# Altium project CLS_Project.PrjPcb (part 1 of 2)
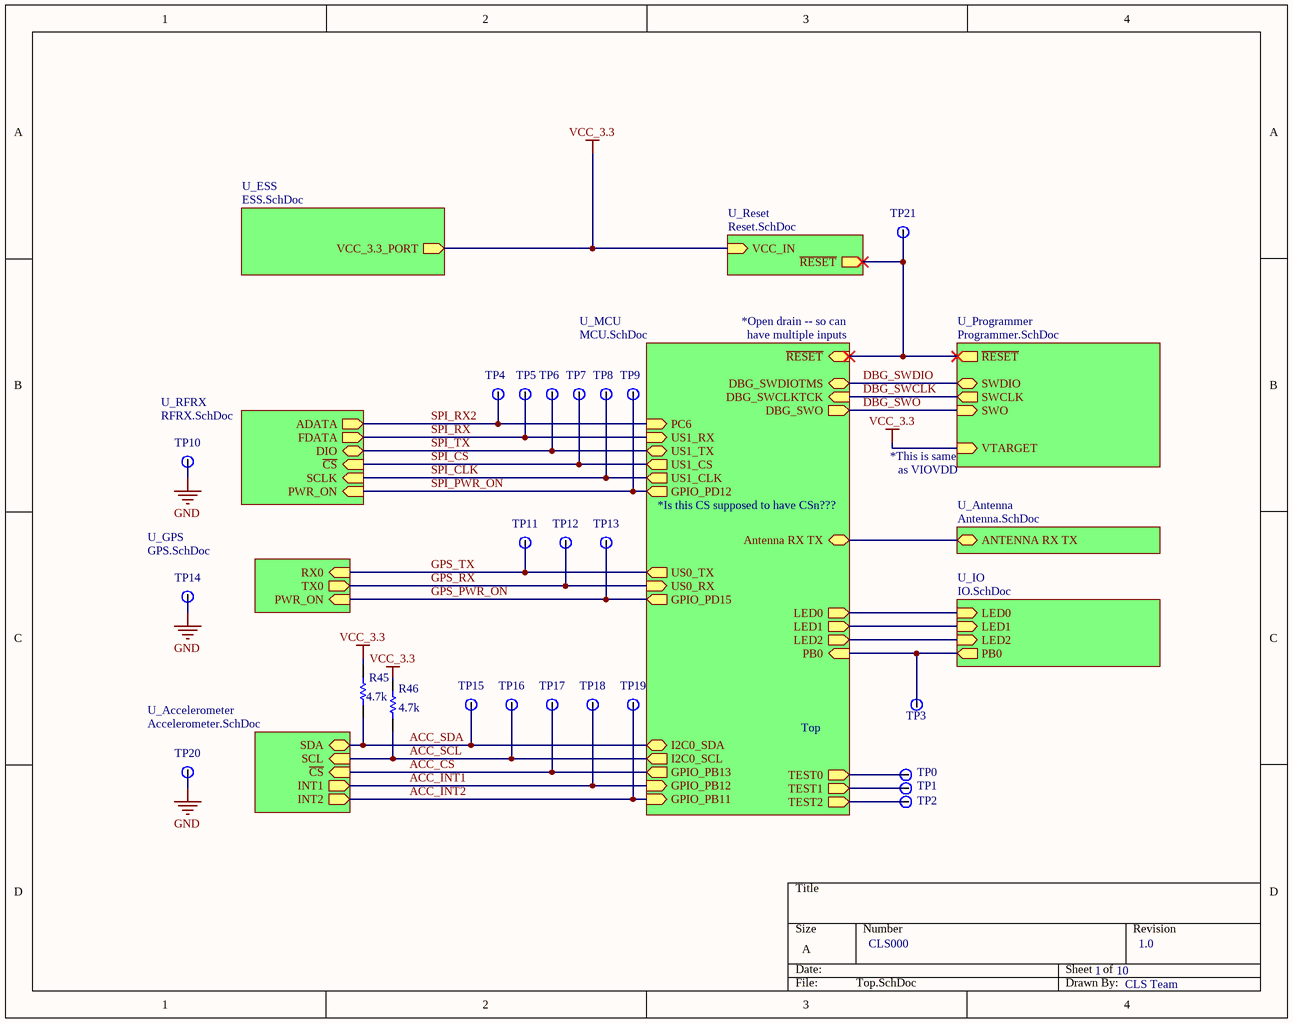
[diagram p0: Top.SchDoc]
10 sheets, 134 parts. Net scope: hierarchical (ports join the sheet entries above them; power ports are global).
Board file: PCB_draft_00.PcbDoc
Sheets:
  Top.SchDoc
    U_MCU = MCU.SchDoc
    U_Accelerometer = Accelerometer.SchDoc
    U_GPS = GPS.SchDoc
    U_Programmer = Programmer.SchDoc
    U_IO = IO.SchDoc
    U_RFRX = RFRX.SchDoc
    U_ESS = ESS.SchDoc
    U_Reset = Reset.SchDoc
    U_Antenna = Antenna.SchDoc

## Sheet Top.SchDoc: Top
size A; Author: CLS Team; Revision: 1.0; SheetNumber: 1; SheetTotal: 10

### Parts
R45  value 4.7k  [0805_CHIP_FP]  (hidden comment: Resistor_0805)
R46  value 4.7k  [0805_CHIP_FP]  (hidden comment: Resistor_0805)
TP0  Testpoint  [HDR1X1]  (value not drawn)
TP1  Testpoint  [HDR1X1]  (value not drawn)
TP2  Testpoint  [HDR1X1]  (value not drawn)
TP3  Testpoint  [HDR1X1]  (value not drawn)
TP4  Testpoint  [HDR1X1]  (value not drawn)
TP5  Testpoint  [HDR1X1]  (value not drawn)
TP6  Testpoint  [HDR1X1]  (value not drawn)
TP7  Testpoint  [HDR1X1]  (value not drawn)
TP8  Testpoint  [HDR1X1]  (value not drawn)
TP9  Testpoint  [HDR1X1]  (value not drawn)
TP10  Testpoint  [HDR1X1]  (value not drawn)
TP11  Testpoint  [HDR1X1]  (value not drawn)
TP12  Testpoint  [HDR1X1]  (value not drawn)
TP13  Testpoint  [HDR1X1]  (value not drawn)
TP14  Testpoint  [HDR1X1]  (value not drawn)
TP15  Testpoint  [HDR1X1]  (value not drawn)
TP16  Testpoint  [HDR1X1]  (value not drawn)
TP17  Testpoint  [HDR1X1]  (value not drawn)
TP18  Testpoint  [HDR1X1]  (value not drawn)
TP19  Testpoint  [HDR1X1]  (value not drawn)
TP20  Testpoint  [HDR1X1]  (value not drawn)
TP21  Testpoint  [HDR1X1]  (value not drawn)

### Sub-sheets
U_Accelerometer = Accelerometer.SchDoc: INT2 (out), SDA (bidir), ~{CS} (in), SCL (in), INT1 (out)
U_Antenna = Antenna.SchDoc: ANTENNA RX TX (bidir)
U_ESS = ESS.SchDoc: VCC_3.3_PORT (out)
U_GPS = GPS.SchDoc: RX0 (in), TX0 (out), PWR_ON (in)
U_IO = IO.SchDoc: LED0 (in), LED1 (in), PB0 (out), LED2 (in)
U_MCU = MCU.SchDoc: US0_RX (in), US0_TX (out), I2C0_SDA (bidir), I2C0_SCL (out), GPIO_PB13 (out), DBG_SWO (out), DBG_SWCLKTCK (in), DBG_SWDIOTMS (bidir), GPIO_PB12 (in), US1_TX (bidir), US1_RX (in), US1_CS (out), US1_CLK (out), GPIO_PD12 (out), GPIO_PB11 (in), ~{RESET} (in), Antenna RX TX (bidir), PC6 (in), GPIO_PD15 (out), LED0 (out), LED2 (out), PB0 (in), TEST1 (out), LED1 (out), TEST2 (out), TEST0 (out)
U_Programmer = Programmer.SchDoc: VTARGET (in), SWDIO (bidir), SWCLK (out), SWO (in), ~{RESET} (out)
U_Reset = Reset.SchDoc: VCC_IN (in), ~{RESET} (out)
U_RFRX = RFRX.SchDoc: SCLK (in), DIO (bidir), ~{CS} (in), FDATA (out), PWR_ON (in), ADATA (out)

### Nets
GND: TP10.1(OUT) TP14.1(OUT) TP20.1(OUT)
VCC_3.3: R45.2 R46.2 ; sheet U_Programmer/VTARGET, sheet U_ESS/VCC_3.3_PORT, sheet U_Reset/VCC_IN
ACC_~{CS}: TP17.1(OUT) ; sheet U_MCU/GPIO_PB13, sheet U_Accelerometer/~{CS}
ACC_INT1: TP18.1(OUT) ; sheet U_MCU/GPIO_PB12, sheet U_Accelerometer/INT1
ACC_INT2: TP19.1(OUT) ; sheet U_MCU/GPIO_PB11, sheet U_Accelerometer/INT2
ACC_SCL: R46.1 TP16.1(OUT) ; sheet U_MCU/I2C0_SCL, sheet U_Accelerometer/SCL
ACC_SDA: R45.1 TP15.1(OUT) ; sheet U_MCU/I2C0_SDA, sheet U_Accelerometer/SDA
DBG_SWCLK: sheet U_MCU/DBG_SWCLKTCK, sheet U_Programmer/SWCLK
DBG_SWDIO: sheet U_MCU/DBG_SWDIOTMS, sheet U_Programmer/SWDIO
DBG_SWO: sheet U_MCU/DBG_SWO, sheet U_Programmer/SWO
GPS_PWR_ON: TP13.1(OUT) ; sheet U_MCU/GPIO_PD15, sheet U_GPS/PWR_ON
GPS_RX: TP12.1(OUT) ; sheet U_MCU/US0_RX, sheet U_GPS/TX0
GPS_TX: TP11.1(OUT) ; sheet U_MCU/US0_TX, sheet U_GPS/RX0
SPI_~{CS}: TP7.1(OUT) ; sheet U_MCU/US1_CS, sheet U_RFRX/~{CS}
SPI_CLK: TP8.1(OUT) ; sheet U_MCU/US1_CLK, sheet U_RFRX/SCLK
SPI_PWR_ON: TP9.1(OUT) ; sheet U_MCU/GPIO_PD12, sheet U_RFRX/PWR_ON
SPI_RX: TP5.1(OUT) ; sheet U_MCU/US1_RX, sheet U_RFRX/FDATA
SPI_RX2: TP4.1(OUT) ; sheet U_MCU/PC6, sheet U_RFRX/ADATA
SPI_TX: TP6.1(OUT) ; sheet U_MCU/US1_TX, sheet U_RFRX/DIO
NetC70_2: TP3.1(OUT) ; sheet U_MCU/PB0, sheet U_IO/PB0
NetG95_15: TP21.1(OUT) ; sheet U_MCU/~{RESET}, sheet U_Programmer/~{RESET}, sheet U_Reset/~{RESET}
NetJU70_1: sheet U_MCU/LED0, sheet U_IO/LED0
NetJU71_1: sheet U_MCU/LED1, sheet U_IO/LED1
NetJU72_1: sheet U_MCU/LED2, sheet U_IO/LED2
NetL31_1: sheet U_MCU/Antenna RX TX, sheet U_Antenna/ANTENNA RX TX
NetTP0_1: TP0.1(OUT) ; sheet U_MCU/TEST0
NetTP1_1: TP1.1(OUT) ; sheet U_MCU/TEST1
NetTP2_1: TP2.1(OUT) ; sheet U_MCU/TEST2

### Notes on the sheet
- *Open drain -- so can
- have multiple inputs
- *This is same
- as VIOVDD
- *Is this CS supposed to have CSn???
- CLS000

### Library data of the parts
R45 R46 = Resistor_0805: Resistor 0805; Manufacturer: Yageo; Manufacturer Part Number: RC0805JR-074K7L; Vendor Part Number: 311-4.7KARCT-ND; Vendor: Digikey; Vendor Description: RES SMD 4.7K OHM 5% 1/8W 0805; ComponentLink1Description: Datasheet; ComponentLink1URL: https://www.digikey.com/product-detail/en/yageo/RC0805JR-074K7L/311-4.7KARCT-ND/731274; Cost: .04
TP0-TP21 = Testpoint: Vendor Part Number: PRT-00116; Vendor: Sparkfun; Vendor Description: Break Away Headers - Straight; ComponentLink1URL: https://www.sparkfun.com/products/116; ComponentLink1Description: Datasheet; Manufacturer: Sparkfun; Manufacturer Part Number: PRT-00116; Cost: bulk

## Sheet MCU.SchDoc: Microcontroller Unit (MCU)
size A; Author: Micheal Burin; Revision: 1.0; SheetNumber: 2; SheetTotal: 10
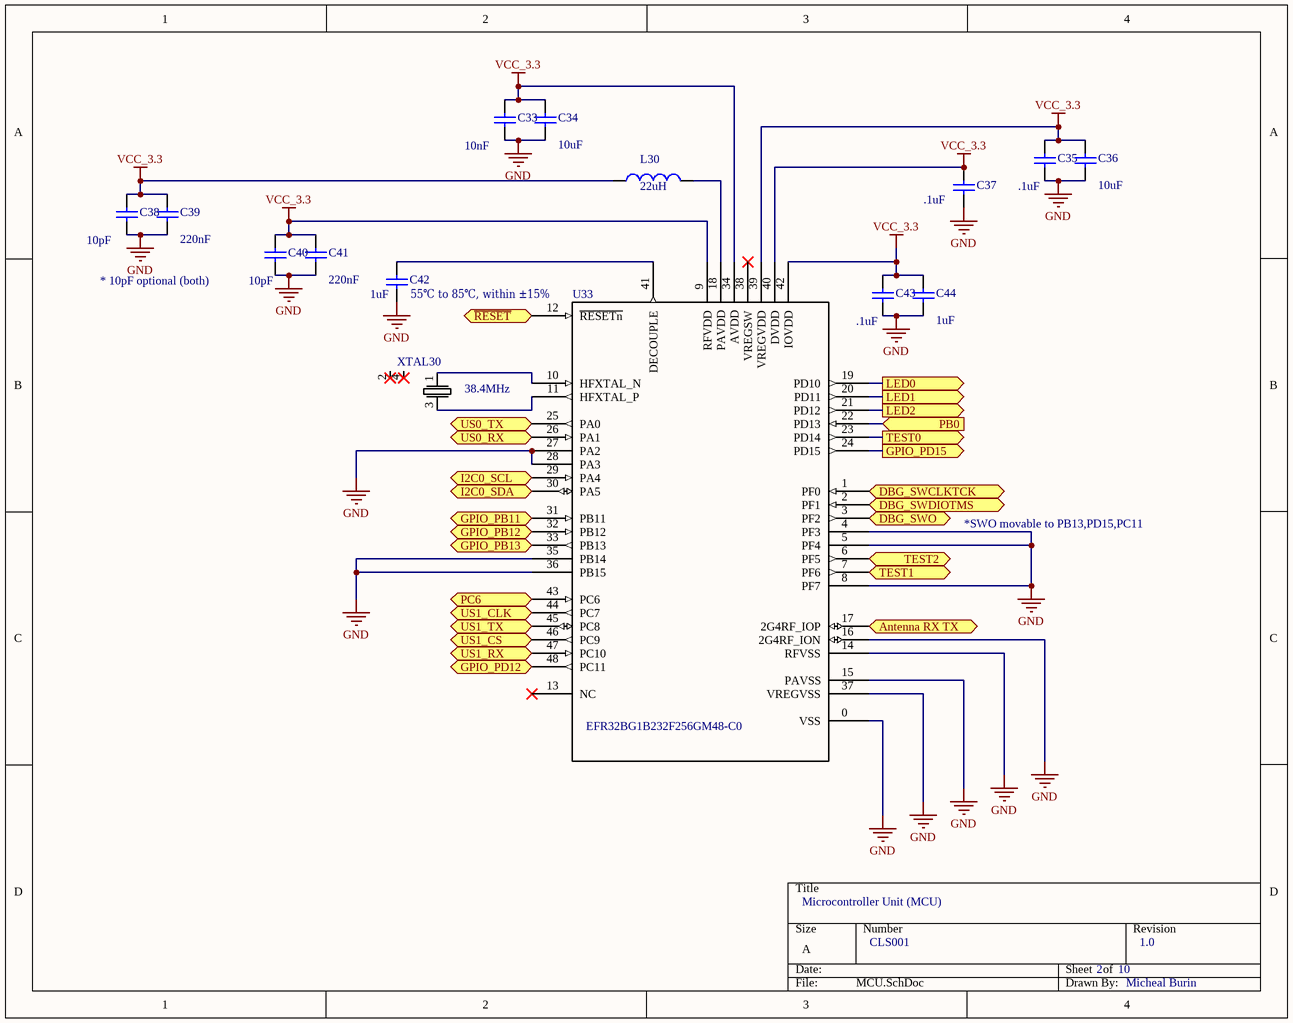
[diagram p1: MCU.SchDoc]

### Parts
C33  value 10nF  [0805_CHIP_FP]  (hidden comment: Capacitor_unpolarized_0805)
C34  value 10uF  [0805_CHIP_FP]  (hidden comment: Capacitor_unpolarized_0805)
C35  value .1uF  [0805_CHIP_FP]  (hidden comment: Capacitor_unpolarized_0805)
C36  value 10uF  [0805_CHIP_FP]  (hidden comment: Capacitor_unpolarized_0805)
C37  value .1uF  [0805_CHIP_FP]  (hidden comment: Capacitor_unpolarized_0805)
C38  value 10pF  [0805_CHIP_FP]  (hidden comment: Capacitor_unpolarized_0805)
C39  value 220nF  [0805_CHIP_FP]  (hidden comment: Capacitor_unpolarized_0805)
C40  value 10pF  [0805_CHIP_FP]  (hidden comment: Capacitor_unpolarized_0805)
C41  value 220nF  [0805_CHIP_FP]  (hidden comment: Capacitor_unpolarized_0805)
C42  value 1uF  [0805_CHIP_FP]  (hidden comment: Capacitor_unpolarized_0805)
C43  value .1uF  [0805_CHIP_FP]  (hidden comment: Capacitor_unpolarized_0805)
C44  value 1uF  [0805_CHIP_FP]  (hidden comment: Capacitor_unpolarized_0805)
L30  value 22uH  [0402_CHIP_FP]  (hidden comment: Inductor)
U33  EFR32BG1B232F256GM48-C0  [QFN127P600-8N]
XTAL30  crystal_4_legged  [OSC-DFN140P160X55-4N]  (value not drawn)

### Ports
Antenna RX TX (bidir), DBG_SWCLKTCK (in), DBG_SWDIOTMS (bidir), DBG_SWO (out), GPIO_PB11 (in), GPIO_PB12 (in), GPIO_PB13 (out), GPIO_PD12 (out), GPIO_PD15 (out), I2C0_SCL (out), I2C0_SDA (bidir), LED0 (out), LED1 (out), LED2 (out), PB0 (in), PC6 (in), TEST0 (out), TEST1 (out), TEST2 (out), US0_RX (in), US0_TX (out), US1_CLK (out), US1_CS (out), US1_RX (in), US1_TX (bidir), ~{RESET} (in)

### Nets
GND: C33.2 C34.2 C35.1 C36.1 C37.1 C38.1 C39.1 C40.1 C41.1 C42.1 C43.1 C44.1 U33.0(VSS) U33.4(PF3) U33.5(PF4) U33.8(PF7) U33.14(RFVSS) U33.15(PAVSS) U33.16(2G4RF_ION) U33.27(PA2) U33.28(PA3) U33.35(PB14) U33.36(PB15) U33.37(VREGVSS)
VCC_3.3: C33.1 C34.1 C35.2 C36.2 C37.2 C38.2 C39.2 C40.2 C41.2 C43.2 C44.2 L30.1 U33.9(RFVDD) U33.34(AVDD) U33.39(VREGVDD) U33.40(DVDD) U33.42(IOVDD)
ACC_~{CS}: U33.33(PB13) ; port GPIO_PB13
ACC_INT1: U33.32(PB12) ; port GPIO_PB12
ACC_INT2: U33.31(PB11) ; port GPIO_PB11
ACC_SCL: U33.29(PA4) ; port I2C0_SCL
ACC_SDA: U33.30(PA5) ; port I2C0_SDA
DBG_SWCLK: U33.1(PF0) ; port DBG_SWCLKTCK
DBG_SWDIO: U33.2(PF1) ; port DBG_SWDIOTMS
DBG_SWO: U33.3(PF2) ; port DBG_SWO
GPS_PWR_ON: U33.24(PD15) ; port GPIO_PD15
GPS_RX: U33.26(PA1) ; port US0_RX
GPS_TX: U33.25(PA0) ; port US0_TX
SPI_~{CS}: U33.46(PC9) ; port US1_CS
SPI_CLK: U33.44(PC7) ; port US1_CLK
SPI_PWR_ON: U33.48(PC11) ; port GPIO_PD12
SPI_RX: U33.47(PC10) ; port US1_RX
SPI_RX2: U33.43(PC6) ; port PC6
SPI_TX: U33.45(PC8) ; port US1_TX
NetC42_2: C42.2 U33.41(DECOUPLE)
NetC70_2: U33.22(PD13) ; port PB0
NetG95_15: U33.12(~{RESETn}) ; port ~{RESET}
NetJU70_1: U33.19(PD10) ; port LED0
NetJU71_1: U33.20(PD11) ; port LED1
NetJU72_1: U33.21(PD12) ; port LED2
NetL30_2: L30.2 U33.18(PAVDD)
NetL31_1: U33.17(2G4RF_IOP) ; port Antenna RX TX
NetTP0_1: U33.23(PD14) ; port TEST0
NetTP1_1: U33.7(PF6) ; port TEST1
NetTP2_1: U33.6(PF5) ; port TEST2
NetU33_10: U33.10(HFXTAL_N) XTAL30.1
NetU33_11: U33.11(HFXTAL_P) XTAL30.3

Not connected (* = marked no-connect by the designer): U33 13(NC)* 38(VREGSW)*; XTAL30 2* 4*

### Notes on the sheet
- * 10pF optional (both)
- 55℃ to 85℃, within ±15%
- (near XTAL30) 38.4MHz
- *SWO movable to PB13,PD15,PC11
- CLS001

### Library data of the parts
C33 = Capacitor_unpolarized_0805: Manufacturer: Samsung Electro-Mechanics; Manufacturer Part Number: CL21B103KAANNNC; Vendor Part Number: 1276-2434-1-ND; Vendor: Digikey; Vendor Description: CAP CER 10000PF 25V X7R 0805; ComponentLink1Description: Datasheet; ComponentLink1URL: https://www.digikey.com/product-detail/en/samsung-electro-mechanics/CL21B103KAANNNC/1276-2434-1-ND/3890520; Cost: .10
C34 C36 = Capacitor_unpolarized_0805: Manufacturer: Samsung Electro-Mechanics; Manufacturer Part Number: CL21A106KPFNNNG; Vendor Part Number: 1276-6456-1-ND; Vendor: Digikey; Vendor Description: CAP CER 10UF 10V X5R 0805; ComponentLink1Description: Datasheet; ComponentLink1URL: https://www.digikey.com/product-detail/en/samsung-electro-mechanics/CL21A106KPFNNNG/1276-6456-1-ND/5958084; Cost: .10
C35 C37 C43 = Capacitor_unpolarized_0805: Manufacturer: Johanson Dielectrics Inc.; Manufacturer Part Number: 250R15W104KV4T; Vendor Part Number: 709-1185-1-ND; Vendor: Digikey; Vendor Description: CAP CER 0.1UF 25V X7R 0805; ComponentLink1Description: Datasheet; ComponentLink1URL: https://www.digikey.com/product-detail/en/johanson-dielectrics-inc/250R15W104KV4T/709-1185-1-ND/1859517; Cost: .18
C38 C40 = Capacitor_unpolarized_0805: Manufacturer: Wurth Electronics Inc.; Manufacturer Part Number: 885012007028; Vendor Part Number: 732-7827-1-ND; Vendor: Digikey; Vendor Description: CAP CER 10PF 25V C0G/NP0 0805; ComponentLink1Description: Datasheet; ComponentLink1URL: https://www.digikey.com/product-detail/en/wurth-electronics-inc/885012007028/732-7827-1-ND/5454454; Cost: .04
C39 C41 = Capacitor_unpolarized_0805: Manufacturer: Wurth Electronics Inc.; Manufacturer Part Number: 885012207074; Vendor Part Number: 732-7668-1-ND; Vendor: Digikey; Vendor Description: CAP CER 0.22UF 25V X7R 0805; ComponentLink1Description: Datasheet; ComponentLink1URL: https://www.digikey.com/product-detail/en/wurth-electronics-inc/885012207074/732-7668-1-ND/5454295; Cost: .11
C42 C44 = Capacitor_unpolarized_0805: Manufacturer: Samsung Electro-Mechanics; Manufacturer Part Number: CL21A105KOFNNNE; Vendor Part Number: 1276-2888-1-ND; Vendor: Digikey; Vendor Description: CAP CER 1UF 16V X5R 0805; ComponentLink1Description: Datasheet; ComponentLink1URL: https://www.digikey.com/product-detail/en/samsung-electro-mechanics/CL21A105KOFNNNE/1276-2888-1-ND/3890974; Cost: .10
L30 = Inductor: Manufacturer: Murata Electronics North America; Manufacturer Part Number: LQG15HS22NJ02D; Vendor Part Number: 490-2627-1-ND; Vendor: Digikey; Vendor Description: FIXED IND 22NH 350MA 420 MOHM; ComponentLink1Description: Datasheet; ComponentLink1URL: https://www.digikey.com/product-detail/en/murata-electronics-north-america/LQG15HS22NJ02D/490-2627-1-ND/662907; Cost: .10
U33 = EFR32BG1B232F256GM48-C0: EFR32BG1B232F256GM48-C0 48 pin; Vendor Part Number: 634-EFR32BG232FGM48C; MF: Silicon Labs; Vendor: Mouser; Vendor Description: RF System on a Chip - SoC Blue Gecko SoC, 2.4 GHz, 256 kB Flash, 32 kB RAM, +10.5 dBm, QFN48, BLE; Value: *; Availability: Unavailable; MP: EFR32BG1B232F256GM48-C0; Price: None; Package: QFN-48; ComponentLink1Description: Datasheet; ComponentLink1URL: https://www.mouser.com/ProductDetail/Silicon-Labs/EFR32BG1B232F256GM48-C0?qs=sGAEpiMZZMuReUCzg6bfTBcjVff43OycMWdVD1zh22U6vZAa%252bEuL6w%3d%3d; Cost: 4.82; Manufacturer: Silicon Labs; Manufacturer Part Number: EFR32BG1B232F256GM48-C0
XTAL30 = crystal_4_legged: crystal; Manufacturer: CTS-Frequency Controls; Manufacturer Part Number: 402F38411CAR; Vendor Part Number: CTX1354CT-ND; Vendor: Digikey; Vendor Description: CRYSTAL 38.4000MHZ 10PF SMD; ComponentLink1Description: Datasheet; ComponentLink1URL: https://www.digikey.com/product-detail/en/cts-frequency-controls/402F38411CAR/CTX1354CT-ND/4972892; Cost: .88

## Sheet Accelerometer.SchDoc: Accelerometer
size A; Author: Micheal Burin; Revision: 1.0; SheetNumber: 8; SheetTotal: 10
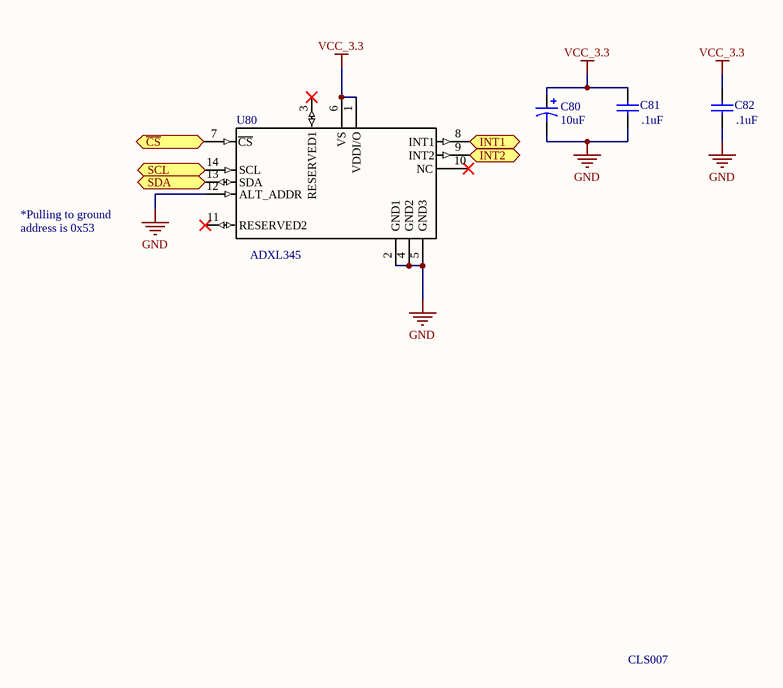
[diagram p2: Accelerometer.SchDoc]

### Parts
C80  value 10uF  [0805_CHIP_FP]  (hidden comment: Capacitor Polarized)
C81  value .1uF  [0805_CHIP_FP]  (hidden comment: Capacitor_unpolarized_0805)
C82  value .1uF  [0805_CHIP_FP]  (hidden comment: Capacitor_unpolarized_0805)
U80  MOTION/POSITION-ADXL345BCCZ-RL(14P-5.0X3.0MM)  [ADI-CC-14-1_V]  (value not drawn)

### Ports
INT1 (out), INT2 (out), SCL (in), SDA (bidir), ~{CS} (in)

### Nets
GND: C80.2 C81.1 C82.1 U80.2(GND1) U80.4(GND2) U80.5(GND3) U80.12(ALT_ADDR)
VCC_3.3: C80.1 C81.2 C82.2 U80.1(VDDI/O) U80.6(VS)
ACC_~{CS}: U80.7(~{CS}) ; port ~{CS}
ACC_INT1: U80.8(INT1) ; port INT1
ACC_INT2: U80.9(INT2) ; port INT2
ACC_SCL: U80.14(SCL) ; port SCL
ACC_SDA: U80.13(SDA) ; port SDA

Not connected (* = marked no-connect by the designer): U80 3(RESERVED1)* 10(NC)* 11(RESERVED2)*

### Notes on the sheet
- *Pulling to ground
- address is 0x53
- (near U80) ADXL345
- CLS007

### Library data of the parts
C80 = Capacitor Polarized: Manufacturer: AVX Corporation; Manufacturer Part Number: TLJR106M010R3000; Vendor Part Number: 478-3346-1-ND; Vendor: Digikey; Vendor Description: CAP TANT 10UF 10V 20% 0805; ComponentLink1Description: Datasheet; ComponentLink1URL: https://www.digikey.com/product-detail/en/avx-corporation/TLJR106M010R3000/478-3346-1-ND/930138; Cost: .57
C81 C82 = Capacitor_unpolarized_0805: as C35 on sheet MCU; ComponentLink1Description: Datasheet; ComponentLink1URL: https://www.digikey.com/product-detail/en/johanson-dielectrics-inc/250R15W104KV4T/709-1185-1-ND/1859517; Cost: .18
U80 = MOTION/POSITION-ADXL345BCCZ-RL(14P-5.0X3.0MM): Accelerometer Triple Â±2/Â±4/Â±8/Â±16g 2V to 3.6V 14-Pin LGA T/R; Manufacturer: Analog Devices Inc.; Vendor Part Number: ADXL345BCCZ-RLCT-ND; Vendor: Digikey; Vendor Description: ACCEL 2-16G I2C/SPI 14LGA; Value: *; ComponentLink1Description: Datasheet; Cost: 4.95; Manufacturer Part Number: ADXL345BCCZ-RL; ComponentLink1URL: https://www.digikey.com/product-detail/en/analog-devices-inc/ADXL345BCCZ-RL/ADXL345BCCZ-RLCT-ND/2237841

## Sheet GPS.SchDoc: GPS
size A; Author: Micheal Burin; Revision: 1.0; SheetNumber: 9; SheetTotal: 10
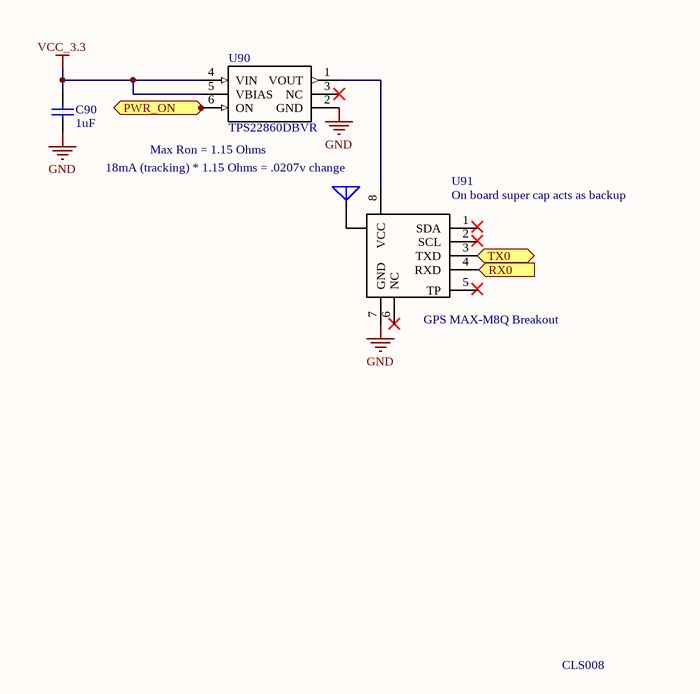
[diagram p3: GPS.SchDoc]

### Parts
C90  value 1uF  [0805_CHIP_FP]  (hidden comment: Capacitor_unpolarized_0603)
U90  TPS22860DBVR  [SOT95P279X145-6N]
U91  GPS MAX-M8Q Breakout  [HDR1X8]

### Ports
PWR_ON (in), RX0 (in), TX0 (out)

### Nets
GND: C90.2 U90.2(GND) U91.7(GND)
VCC_3.3: C90.1 U90.4(VIN) U90.5(VBIAS)
GPS_RX: U91.3(TXD) ; port TX0
GPS_TX: U91.4(RXD) ; port RX0
NetU90_1: U90.1(VOUT) U91.8(VCC)

Not connected (* = marked no-connect by the designer): U90 3(NC)* 6(ON); U91 1(SDA) 2(SCL) 5(TP) 6(NC) 9(A)

### Notes on the sheet
- (near U91) 18mA (tracking) * 1.15 Ohms = .0207v change
- (near U90) Max Ron = 1.15 Ohms
- (near U91) On board super cap acts as backup
- CLS008

### Library data of the parts
C90 = Capacitor_unpolarized_0603: Manufacturer: Samsung Electro-Mechanics; Manufacturer Part Number: CL21A105KOFNNNE; Vendor Part Number: 1276-2888-1-ND; Vendor: Digikey; Vendor Description: CAP CER 1UF 16V X5R 0805; ComponentLink1Description: Datasheet; ComponentLink1URL: https://www.digikey.com/product-detail/en/samsung-electro-mechanics/CL21A105KOFNNNE/1276-2888-1-ND/3890974; Cost: .10
U90 = TPS22860DBVR: TPS22860 Ultra-low leakage load switch 6-SOT-23 -40 to 85; Manufacturer: Texas Instruments; Vendor Part Number: 296-43982-1-ND; Vendor: Digikey; Vendor Description: IC SWITCH SPDT SOT23-6; Value: *; ComponentLink1Description: Datasheet; Cost: .84; Manufacturer Part Number: TPS22860DBVR; ComponentLink1URL: https://www.digikey.com/product-detail/en/texas-instruments/TPS22860DBVR/296-43982-1-ND/5973206
U91 = GPS MAX-M8Q Breakout: uBLOX MAX-M8Q GPS Breakout for Active; Manufacturer: Airspy; Manufacturer Part Number: UPU-uBLOX M8Q3A SMA; Vendor Description: uBLOX MAX-M8Q GPS Breakout for Active Antennas; ComponentLink1Description: Datasheet; ComponentLink1URL: https://v3.airspy.us/product/upu-ublox-m8q3a-sma/; Cost: 33.95; Vendor: Airspy; Vendor Part Number: UPU-uBLOX M8Q3A SMA

## Sheet Programmer.SchDoc: Programmer
size A; Author: Micheal Burin; Revision: 1.0; SheetNumber: 4; SheetTotal: 10
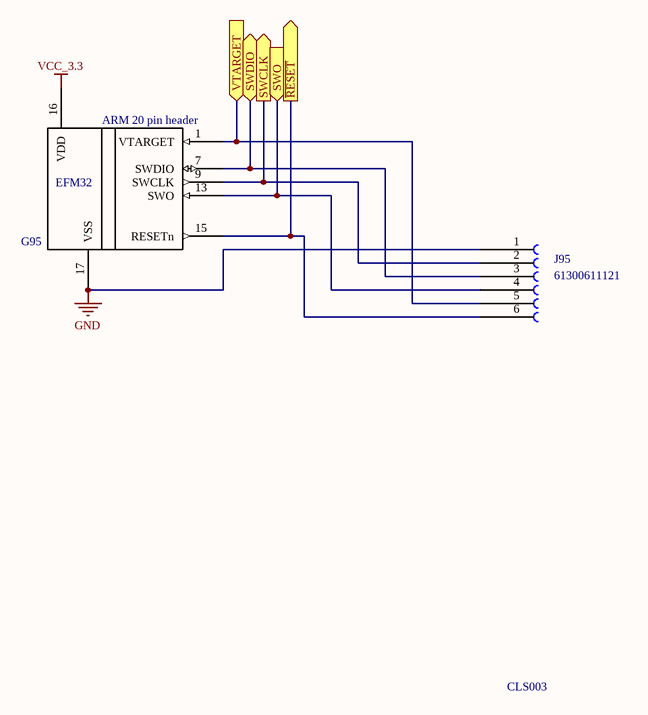
[diagram p4: Programmer.SchDoc]

### Parts
G95  Gecko_Debug_Board_Connection  (value not drawn)
J95  61300611121  [61300611121]

### Ports
SWCLK (out), SWDIO (bidir), SWO (in), VTARGET (in), ~{RESET} (out)

### Nets
GND: G95.17(VSS) J95.1
VCC_3.3: G95.1(VTARGET) G95.16(VDD) J95.5 ; port VTARGET
DBG_SWCLK: G95.9(SWCLK) J95.2 ; port SWCLK
DBG_SWDIO: G95.7(SWDIO) J95.3 ; port SWDIO
DBG_SWO: G95.13(SWO) J95.4 ; port SWO
NetG95_15: G95.15(RESETn) J95.6 ; port ~{RESET}

### Notes on the sheet
- CLS003
- (in symbol Gecko_Debug_Board_Connection) ARM 20 pin header; EFM32

### Library data of the parts
G95 = Gecko_Debug_Board_Connection: Leopard Gecko Debug; Vendor Part Number: ECOT 435; Manufacturer Part Number: EFM32LG-STK3600; Vendor: Professor Graham; Vendor Description: Leopard Gecko Board; ComponentLink1Description: *; ComponentLink1URL: *; Cost: 0; Manufacturer: *
J95 = 61300611121: Board-To-Board Connector, Vertical, WR-PHD Series, Through Hole, Header, 6, 2.54 mm; Manufacturer: CONN HEADER 6 POS 2.54; Vendor Part Number: 732-5319-ND; Vendor: Digikey; Vendor Description: CONN HEADER 6 POS 2.54 x2; Value: *; ComponentLink1Description: Datasheet; ComponentLink1URL: https://www.digikey.com/products/en?keywords=732-5319-ND; Cost: .33; Manufacturer Part Number: 61300611121

## Sheet IO.SchDoc: IO
size A; Author: Micheal Burin; Revision: 1.0; SheetNumber: 7; SheetTotal: 10
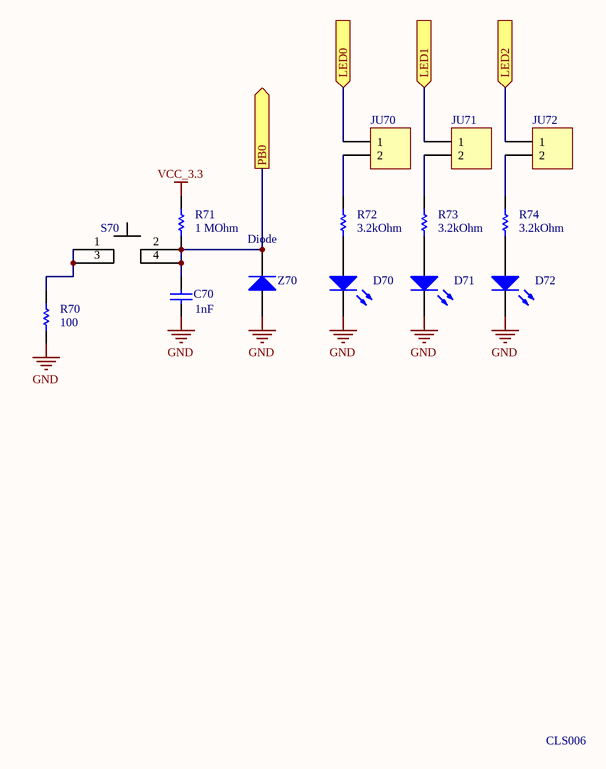
[diagram p5: IO.SchDoc]

### Parts
C70  value 1nF  [0805_CHIP_FP]  (hidden comment: Capacitor_unpolarized_0603)
D70  LED Generic  [LED_FP]  (value not drawn)
D71  LED Generic  [LED_FP]  (value not drawn)
D72  LED Generic  [LED_FP]  (value not drawn)
JU70  Header 2  [HDR1X2]  (value not drawn)
JU71  Header 2  [HDR1X2]  (value not drawn)
JU72  Header 2  [HDR1X2]  (value not drawn)
R70  value 100  [0805_CHIP_FP]  (hidden comment: Resistor_0805)
R71  value 1 MOhm  [0805_CHIP_FP]  (hidden comment: Resistor_0805)
R72  value 3.2kOhm  [0805_CHIP_FP]  (hidden comment: Resistor_0805)
R73  value 3.2kOhm  [0805_CHIP_FP]  (hidden comment: Resistor_0805)
R74  value 3.2kOhm  [0805_CHIP_FP]  (hidden comment: Resistor_0805)
S70  Switch  [Pushbutton]  (value not drawn)
Z70  Diode  [0603_CHIP_FP]

### Ports
LED0 (in), LED1 (in), LED2 (in), PB0 (out)

### Nets
GND: C70.1 D70.2(K) D71.2(K) D72.2(K) R70.1 Z70.2(Cathode)
VCC_3.3: R71.2
NetC70_2: C70.2 R71.1 S70.2 S70.4 Z70.1(Anode) ; port PB0
NetD70_1: D70.1(A) R72.1
NetD71_1: D71.1(A) R73.1
NetD72_1: D72.1(A) R74.1
NetJU70_1: JU70.1 ; port LED0
NetJU70_2: JU70.2 R72.2
NetJU71_1: JU71.1 ; port LED1
NetJU71_2: JU71.2 R73.2
NetJU72_1: JU72.1 ; port LED2
NetJU72_2: JU72.2 R74.2
NetR70_2: R70.2 S70.1 S70.3

### Notes on the sheet
- CLS006

### Library data of the parts
C70 = Capacitor_unpolarized_0603: Manufacturer: Johanson Dielectrics Inc.; Manufacturer Part Number: 500R15N102JV4T; Vendor Part Number: 709-1180-1-ND; Vendor: Digikey; Vendor Description: CAP CER 1000PF 50V C0G/NP0 0805; ComponentLink1Description: Datasheet; ComponentLink1URL: https://www.digikey.com/product-detail/en/johanson-dielectrics-inc/500R15N102JV4T/709-1180-1-ND/1859512; Cost: .30
D70 = LED_generic: Manufacturer: Broadcom Limited; Manufacturer Part Number: HLMP-P156-HK011; Vendor Part Number: 516-4089-1-ND; Vendor: Digikey; Vendor Description: LED RED CLEAR FLAT 2SMD GW; ComponentLink1Description: Datasheet; ComponentLink1URL: https://www.digikey.com/product-detail/en/broadcom-limited/HLMP-P156-HK011/516-4089-1-ND/9178267; Cost: .676
D71 D72 = LED_generic: LED RED CLEAR FLAT 2SMD GW; Manufacturer: Broadcom Limited; Manufacturer Part Number: HLMP-P156-HK011; Vendor Part Number: 516-4089-1-ND; Vendor: Digikey; ComponentLink1Description: Datasheet; ComponentLink1URL: https://www.digikey.com/product-detail/en/broadcom-limited/HLMP-P156-HK011/516-4089-1-ND/9178267; Cost: .676; Vendor Description: LED RED CLEAR FLAT 2SMD GW
JU70-JU72 = Header 2: CONN HEADER .100 SINGL STR 36POS; Vendor Part Number: PRT-00116; Vendor: Digikey; Vendor Description: .100 mil pitch male header x2; ComponentLink1Description: Datasheet; ComponentLink1URL: https://www.digikey.com/product-detail/en/sullins-connector-solutions/PEC36SAAN/S1012E-36-ND/859153; Cost: bulk
R70 = Resistor_0805: Manufacturer: Yageo; Manufacturer Part Number: RC0805FR-07100RL; Vendor Part Number: 311-100CRCT-ND; Vendor: Digikey; Vendor Description: RES SMD 100 OHM 1% 1/8W 0805; ComponentLink1Description: Datasheet; ComponentLink1URL: https://www.digikey.com/product-detail/en/yageo/RC0805FR-07100RL/311-100CRCT-ND/730490; Cost: .10
R71 = Resistor_0805: Manufacturer: Yageo; Manufacturer Part Number: RC0805FR-071ML; Vendor Part Number: 311-1.00MCRCT-ND; Vendor: Digikey; Vendor Description: RES SMD 1M OHM 1% 1/8W 0805; ComponentLink1Description: Datasheet; ComponentLink1URL: https://www.digikey.com/products/en?keywords=311-1.00MCRCT-ND; Cost: .05
R72-R74 = Resistor_0805: Manufacturer: Yageo; Manufacturer Part Number: RC0805FR-073K24L; Vendor Part Number: 311-3.24KCRCT-ND; Vendor: Digikey; Vendor Description: RES SMD 3.24K OHM 1% 1/8W 0805; ComponentLink1Description: Datasheet; ComponentLink1URL: https://www.digikey.com/product-detail/en/yageo/RC0805FR-073K24L/311-3.24KCRCT-ND/730758; Cost: .05
S70 = Pushbutton: Pushbutton Switch; Manufacturer: APEM Inc.; Manufacturer Part Number: MJTP1230; Vendor Part Number: 679-2428-ND; Vendor: Digikey; Vendor Description: SWITCH TACTILE SPST-NO 0.05A 12V; ComponentLink1Description: Datasheet; ComponentLink1URL: https://www.digikey.com/product-detail/en/apem-inc/MJTP1230/679-2428-ND/1798037; Cost: .11
Z70 = Diode: Default Diode; Manufacturer: STMicroelectronics; Manufacturer Part Number: ESDA7P120-1U1M; Vendor Part Number: 497-17159-1-ND; Vendor: Digikey; Vendor Description: TVS DIODE 5.5V 11.5V 1610; ComponentLink1Description: Datasheet; ComponentLink1URL: https://www.digikey.com/product-detail/en/stmicroelectronics/ESDA7P120-1U1M/497-17159-1-ND/6709859; Cost: .38

## Sheet RFRX.SchDoc: RF Receiver 315 MHz (RFRX)
size A; Author: Kathy Grimes; Revision: 1.0; SheetNumber: 10; SheetTotal: 10
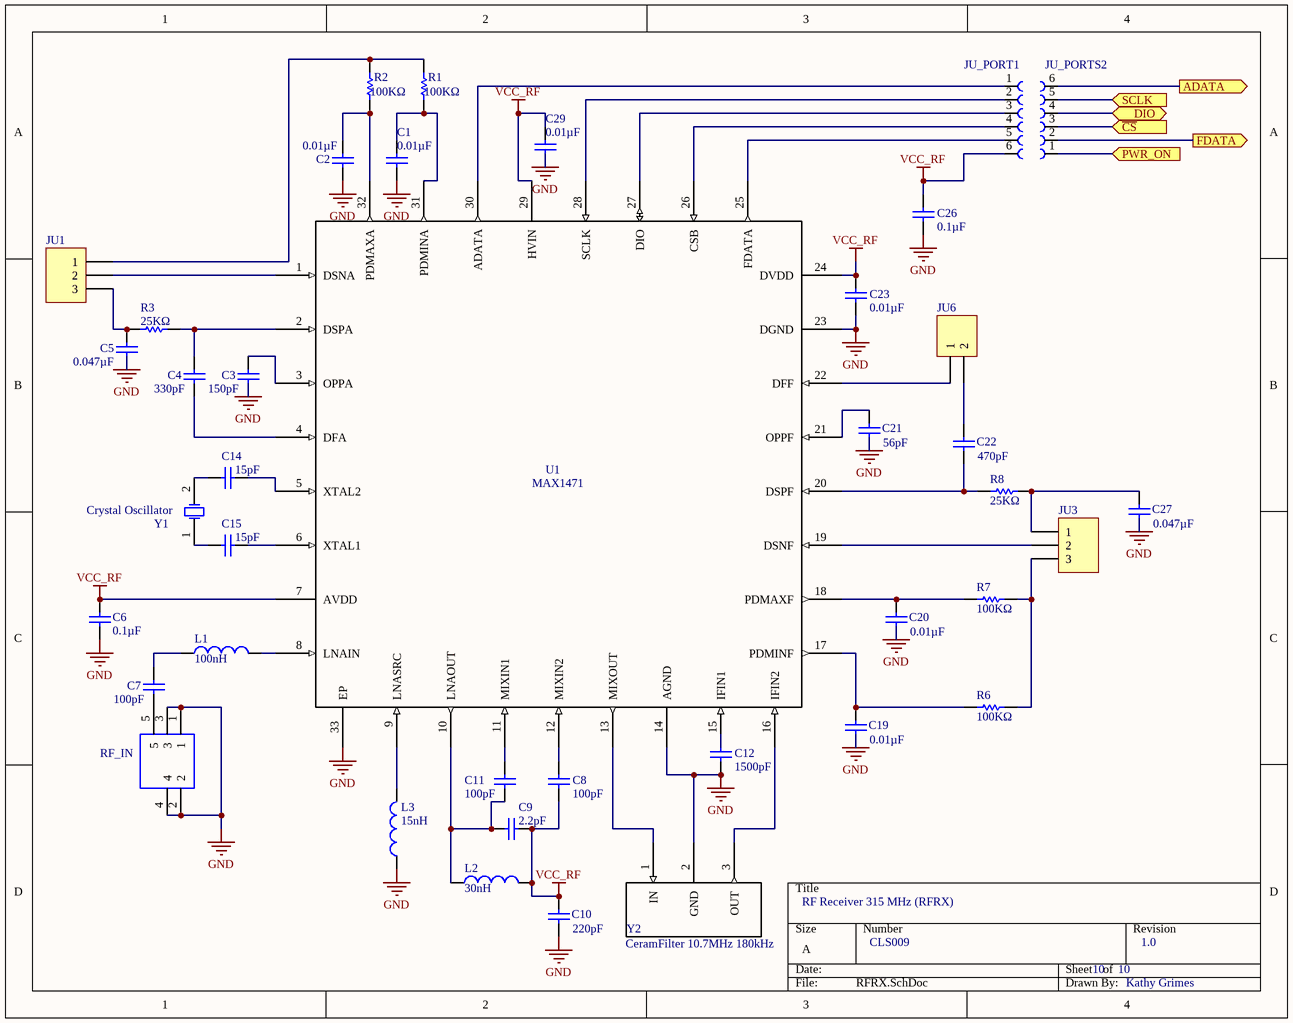
[diagram p6: RFRX.SchDoc]

### Parts
C1  value 0.01µF  [0603_CHIP_FP]  (hidden comment: Capacitor_unpolarized_0603)
C2  value 0.01µF  [0603_CHIP_FP]  (hidden comment: Capacitor_unpolarized_0603)
C3  value 150pF  [0603_CHIP_FP]  (hidden comment: Capacitor_unpolarized_0603)
C4  value 330pF  [0603_CHIP_FP]  (hidden comment: Capacitor_unpolarized_0603)
C5  value 0.047µF  [0603_CHIP_FP]  (hidden comment: Capacitor_unpolarized_0603)
C6  value 0.1µF  [0603_CHIP_FP]  (hidden comment: Capacitor_unpolarized_0603)
C7  value 100pF  [0603_CHIP_FP]  (hidden comment: Capacitor_unpolarized_0603)
C8  value 100pF  [0603_CHIP_FP]  (hidden comment: Capacitor_unpolarized_0603)
C9  value 2.2pF  [0603_CHIP_FP]  (hidden comment: Capacitor_unpolarized_0603)
C10  value 220pF  [0603_CHIP_FP]  (hidden comment: Capacitor_unpolarized_0603)
C11  value 100pF  [0603_CHIP_FP]  (hidden comment: Capacitor_unpolarized_0603)
C12  value 1500pF  [0603_CHIP_FP]  (hidden comment: Capacitor_unpolarized_0603)
C14  value 15pF  [0603_CHIP_FP]  (hidden comment: Capacitor_unpolarized_0603)
C15  value 15pF  [0603_CHIP_FP]  (hidden comment: Capacitor_unpolarized_0603)
C19  value 0.01µF  [0603_CHIP_FP]  (hidden comment: Capacitor_unpolarized_0603)
C20  value 0.01µF  [0603_CHIP_FP]  (hidden comment: Capacitor_unpolarized_0603)
C21  value 56pF  [0603_CHIP_FP]  (hidden comment: Capacitor_unpolarized_0603)
C22  value 470pF  [0603_CHIP_FP]  (hidden comment: Capacitor_unpolarized_0603)
C23  value 0.01µF  [0603_CHIP_FP]  (hidden comment: Capacitor_unpolarized_0603)
C26  value 0.1µF  [0603_CHIP_FP]  (hidden comment: Capacitor_unpolarized_0603)
C27  value 0.047µF  [0603_CHIP_FP]  (hidden comment: Capacitor_unpolarized_0603)
C29  value 0.01µF  [0603_CHIP_FP]  (hidden comment: Capacitor_unpolarized_0603)
CeramFilter_10.7MHz_180kHz  Y2  [SFECV10M7CQ0C01R0]
Crystal_Oscillator  Y1  [XTAL_ECS-100-18-4X]
JU1  Header 3  [HDR1X3]  (value not drawn)
JU3  Header 3  [HDR1X3]  (value not drawn)
JU6  Header 2  [HDR1X2]  (value not drawn)
JU_PORT1  61300611121  [61300611121]  (value not drawn)
JU_PORTS2  61300611121  [61300611121]  (value not drawn)
L1  value 100nH  [0603_CHIP_FP]  (hidden comment: Inductor)
L2  value 30nH  [0603_CHIP_FP]  (hidden comment: Inductor)
L3  value 15nH  [0603_CHIP_FP]  (hidden comment: Inductor)
R1  value 100KΩ  [0603_CHIP_FP]  (hidden comment: Resistor)
R2  value 100KΩ  [0603_CHIP_FP]  (hidden comment: Resistor)
R3  value 25KΩ  [0603_CHIP_FP]  (hidden comment: Resistor)
R6  value 100KΩ  [0603_CHIP_FP]  (hidden comment: Resistor)
R7  value 100KΩ  [0603_CHIP_FP]  (hidden comment: Resistor)
R8  value 25KΩ  [0603_CHIP_FP]  (hidden comment: Resistor)
RF_IN  142-0701-201  [142-0701-201]  (value not drawn)
U1  MAX1471  [QFN50P500X500X80-33N]

### Ports
ADATA (out), DIO (bidir), FDATA (out), PWR_ON (in), SCLK (in), ~{CS} (in)

### Nets
GND: C1.1 C2.1 C3.2 C5.1 C6.2 C10.1 C12.1 C19.1 C20.1 C21.1 C23.1 C26.1 C27.1 C29.1 CeramFilter_10.7MHz_180kHz.2(GND) L3.1 RF_IN.1 RF_IN.2 RF_IN.3 RF_IN.4 U1.14(AGND) U1.23(DGND) U1.33(EP)
VCC_RF: C6.1 C8.1 C9.1 C10.2 C23.2 C26.2 C29.2 JU_PORT1.6 L2.2 U1.7(AVDD) U1.24(DVDD) U1.29(HVIN)
SPI_~{CS}: JU_PORTS2.3 ; port ~{CS}
SPI_CLK: JU_PORTS2.5 ; port SCLK
SPI_PWR_ON: JU_PORTS2.1 ; port PWR_ON
SPI_RX: JU_PORTS2.2 ; port FDATA
SPI_RX2: JU_PORTS2.6 ; port ADATA
SPI_TX: JU_PORTS2.4 ; port DIO
NetC1_2: C1.2 R1.1 U1.31(PDMINA)
NetC2_2: C2.2 R2.1 U1.32(PDMAXA)
NetC3_1: C3.1 U1.3(OPPA)
NetC4_1: C4.1 R3.1 U1.2(DSPA)
NetC4_2: C4.2 U1.4(DFA)
NetC5_2: C5.2 JU1.3 R3.2
NetC7_1: C7.1 L1.1
NetC7_2: C7.2 RF_IN.5
NetC8_2: C8.2 U1.12(MIXIN2)
NetC9_2: C9.2 C11.1 L2.1 U1.10(LNAOUT)
NetC11_2: C11.2 U1.11(MIXIN1)
NetC12_2: C12.2 U1.15(IFIN1)
NetC14_1: C14.1 U1.5(XTAL2)
NetC14_2: C14.2 Crystal_Oscillator.2(OSC2)
NetC15_1: C15.1 U1.6(XTAL1)
NetC15_2: C15.2 Crystal_Oscillator.1(OSC1)
NetC19_2: C19.2 R6.2 U1.17(PDMINF)
NetC20_2: C20.2 R7.2 U1.18(PDMAXF)
NetC21_2: C21.2 U1.21(OPPF)
NetC22_1: C22.1 R8.2 U1.20(DSPF)
NetC22_2: C22.2 JU6.2
NetC27_2: C27.2 JU3.1 R8.1
NetCeramFilter_10.7MHz_180kHz_1: CeramFilter_10.7MHz_180kHz.1(IN) U1.13(MIXOUT)
NetCeramFilter_10.7MHz_180kHz_3: CeramFilter_10.7MHz_180kHz.3(OUT) U1.16(IFIN2)
NetJU1_1: JU1.1 R1.2 R2.2
NetJU1_2: JU1.2 U1.1(DSNA)
NetJU3_2: JU3.2 U1.19(DSNF)
NetJU3_3: JU3.3 R6.1 R7.1
NetJU6_1: JU6.1 U1.22(DFF)
NetJU_PORT1_1: JU_PORT1.1 U1.30(ADATA)
NetJU_PORT1_2: JU_PORT1.2 U1.28(SCLK)
NetJU_PORT1_3: JU_PORT1.3 U1.27(DIO)
NetJU_PORT1_4: JU_PORT1.4 U1.26(CSB)
NetJU_PORT1_5: JU_PORT1.5 U1.25(FDATA)
NetL1_2: L1.2 U1.8(LNAIN)
NetL3_2: L3.2 U1.9(LNASRC)

### Notes on the sheet
- CLS009

### Library data of the parts
C1 C2 C19 C20 C23 C29 = Capacitor_unpolarized_0603: CAP CER 10000PF 50V X7R 0603; Manufacturer: Murata Electronics North America; Manufacturer Part Number: GCM188R71H103KA37D; Vendor Part Number: 490-4778-1-ND; Vendor: Digikey; ComponentLink1Description: Datasheet; ComponentLink1URL: https://www.digikey.com/product-detail/en/murata-electronics-north-america/GCM188R71H103KA37D/490-4778-1-ND/1641697; Cost: .071; Vendor Description: CAP CER 10000PF 50V X7R 0603
C3 = Capacitor_unpolarized_0603: CAP CER 150PF 100V C0G/NP0 0603; Manufacturer: Murata Electronics North America; Manufacturer Part Number: GCM1885C2A151JA16D; Vendor Part Number: 490-4946-1-ND; Vendor: Digikey; ComponentLink1Description: Datasheet; ComponentLink1URL: https://www.digikey.com/product-detail/en/murata-electronics-north-america/GCM1885C2A151JA16D/490-4946-1-ND/1765265; Cost: .15; Vendor Description: CAP CER 150PF 100V C0G/NP0 0603
C4 = Capacitor_unpolarized_0603: CAP CER 330PF 100V C0G/NP0 0603; Manufacturer: Murata Electronics North America; Manufacturer Part Number: GCM1885C2A331JA16D; Vendor Part Number: 490-4948-1-ND; Vendor: Digikey; ComponentLink1Description: Datasheet; ComponentLink1URL: https://www.digikey.com/products/en/capacitors/ceramic-capacitors/60?k=&pkeyword=&pv2049=u330pF&pv3=1&pv3=4&pv3=2&sf=0&FV=fffc01ea%2Cfffc0227%2Cfffc1f73%2C1c0002%2C400005%2C11401c5%2C3f0007c%2C3f00019%2C3f0001b%2C3f00028%2C3f0003f%2C1f140000%2Cffe0003c&quantity=&ColumnSort=-1000002&page=1&pageSize=25; Cost: .19; Vendor Description: CAP CER 330PF 100V C0G/NP0 0603
C5 C27 = Capacitor_unpolarized_0603: CAP CER 0.047UF 25V X7R 0603; Manufacturer: Murata Electronics North America; Manufacturer Part Number: GRM188R71E473JA01D; Vendor Part Number: 490-11528-1-ND; Vendor: Digikey; ComponentLink1Description: Datasheet; ComponentLink1URL: https://www.digikey.com/product-detail/en/murata-electronics-north-america/GRM188R71E473JA01D/490-11528-1-ND/5333368; Cost: .112; Vendor Description: CAP CER 0.047UF 25V X7R 0603
C6 C26 = Capacitor_unpolarized_0603: CAP CER 0.1UF 100V X7R 0603; Manufacturer: Murata Electronics North America; Manufacturer Part Number: GRM188R72A104KA35D; Vendor Part Number: 490-3285-1-ND; Vendor: Digikey; ComponentLink1Description: Datasheet; ComponentLink1URL: https://www.digikey.com/product-detail/en/murata-electronics-north-america/GRM188R72A104KA35D/490-3285-1-ND/702826; Cost: .201; Vendor Description: CAP CER 0.1UF 100V X7R 0603
C7 C8 C11 = Capacitor_unpolarized_0603: CAP CER 100PF 100V C0G/NP0 0603; Manufacturer: Murata Electronics North America; Manufacturer Part Number: GCM1885C2A101JA16D; Vendor Part Number: 490-4771-1-ND; Vendor: Digikey; ComponentLink1Description: Datasheet; ComponentLink1URL: https://www.digikey.com/product-detail/en/murata-electronics-north-america/GCM1885C2A101JA16D/490-4771-1-ND/1641690; Cost: .097; Vendor Description: CAP CER 100PF 100V C0G/NP0 0603
C9 = Capacitor_unpolarized_0603: CAP CER 2.2PF 100V C0G/NP0 0603; Manufacturer: Murata Electronics North America; Manufacturer Part Number: GQM1885C2A2R2BB01D; Vendor Part Number: 490-4838-1-ND; Vendor: Digikey; ComponentLink1Description: Datasheet; ComponentLink1URL: https://www.digikey.com/product-detail/en/murata-electronics-north-america/GQM1885C2A2R2BB01D/490-4838-1-ND/1687484; Cost: .74; Vendor Description: CAP CER 2.2PF 100V C0G/NP0 0603
C10 = Capacitor_unpolarized_0603: CAP CER 220PF 100V X7R 0603; Manufacturer: Murata Electronics North America; Manufacturer Part Number: GRM188R72A221KA01D; Vendor Part Number: 490-1460-1-ND; Vendor: Digikey; ComponentLink1Description: Datasheet; ComponentLink1URL: https://www.digikey.com/product-detail/en/murata-electronics-north-america/GRM188R72A221KA01D/490-1460-1-ND/587749; Cost: .092; Vendor Description: CAP CER 220PF 100V X7R 0603
C12 = Capacitor_unpolarized_0603: CAP CER 1500PF 100V X7R 0603; Manufacturer: Murata Electronics North America; Manufacturer Part Number: GRM188R72A152KA01D; Vendor Part Number: 490-1475-1-ND; Vendor: Digikey; ComponentLink1Description: Datasheet; ComponentLink1URL: https://www.digikey.com/product-detail/en/murata-electronics-north-america/GRM188R72A152KA01D/490-1475-1-ND/587850; Cost: .13; Vendor Description: CAP CER 1500PF 100V X7R 0603
C14 C15 = Capacitor_unpolarized_0603: CAP CER 15PF 50V C0G/NP0 0603; Manufacturer: Murata Electronics North America; Manufacturer Part Number: GQM1885C1H150JB01D; Vendor Part Number: 490-3572-1-ND; Vendor: Digikey; ComponentLink1Description: Datasheet; ComponentLink1URL: https://www.digikey.com/product-detail/en/murata-electronics-north-america/GQM1885C1H150JB01D/490-3572-1-ND/789572; Cost: .581; Vendor Description: CAP CER 15PF 50V C0G/NP0 0603
C21 = Capacitor_unpolarized_0603: CAP CER 56PF 100V C0G/NP0 0603; Manufacturer: Murata Electronics North America; Manufacturer Part Number: GCM1885C2A560JA16D; Vendor Part Number: 490-17769-1-ND; Vendor: Digikey; ComponentLink1Description: Datasheet; ComponentLink1URL: https://www.digikey.com/product-detail/en/murata-electronics-north-america/GCM1885C2A560JA16D/490-17769-1-ND/8540005; Cost: .12; Vendor Description: CAP CER 56PF 100V C0G/NP0 0603
C22 = Capacitor_unpolarized_0603: CAP CER 470PF 100V C0G/NP0 0603; Manufacturer: Murata Electronics North America; Manufacturer Part Number: GCM1885C2A471JA16D; Vendor Part Number: 490-4949-1-ND; Vendor: Digikey; ComponentLink1Description: Datasheet; ComponentLink1URL: https://www.digikey.com/products/en/capacitors/ceramic-capacitors/60?k=&pkeyword=&pv2049=u470pF&pv3=1&pv3=4&pv3=2&sf=0&FV=fffc01ea%2Cfffc0227%2Cfffc1f73%2C1c0002%2C400005%2C11401c5%2C3f0007c%2C3f00019%2C3f0001b%2C3f00028%2C3f0003f%2C1f140000%2Cffe0003c&quantity=&ColumnSort=-1000002&page=1&pageSize=25; Cost: .166; Vendor Description: CAP CER 470PF 100V C0G/NP0 0603
CeramFilter_10.7MHz_180kHz = Component_1: Signal Conditioning 10.7MHZ 330 OHM CERA; Manufacturer: Murata Electronics; Manufacturer Part Number: SFECV10M7FA00-R0; Vendor Part Number: 81-SFECV10M7FA00-R0; Vendor: Mouser; ComponentLink1Description: Datasheet; ComponentLink1URL: https://www.mouser.com/ProductDetail/Murata-Electronics/SFECV10M7FA00-R0?qs=sGAEpiMZZMtMMXztyU6kdIFTJJQM3M6Q8oelu8IKNP4%3d; Cost: .99; Vendor Description: Signal Conditioning 10.7MHZ 330 OHM CERA
Crystal_Oscillator = XTAL: Manufacturer: ECS Inc.; Manufacturer Part Number: ECS-95.4-S-4; Vendor Part Number: X420-ND; Vendor: Digikey; Vendor Description: CRYSTAL 9.5450MHZ SERIES T/H; ComponentLink1Description: Datasheet; ComponentLink1URL: https://www.digikey.com/product-detail/en/ecs-inc/ECS-95.4-S-4/X420-ND/79307; Cost: .69
JU1 JU3 = Header 3: CONN HEADER .100 SINGL STR 36POS; Vendor Part Number: PRT-00116; Vendor: Digikey; Vendor Description: .100 mil pitch male header x3; ComponentLink1Description: Datasheet; ComponentLink1URL: https://www.digikey.com/product-detail/en/sullins-connector-solutions/PEC36SAAN/S1012E-36-ND/859153; Cost: bulk
JU6 = Header 2: as JU70 on sheet IO; ComponentLink1Description: Datasheet; ComponentLink1URL: https://www.digikey.com/product-detail/en/sullins-connector-solutions/PEC36SAAN/S1012E-36-ND/859153; Cost: bulk
JU_PORT1 JU_PORTS2 = 61300611121: Board-To-Board Connector, Vertical, WR-PHD Series, Through Hole, Header, 6, 2.54 mm; Manufacturer: CONN HEADER 6 POS 2.54; Vendor Part Number: 732-5319-ND; MF: Wurth Electronics; Vendor: Digikey; Vendor Description: CONN HEADER 6 POS 2.54 x2; MP: 61300611121; Availability: Unavailable; SnapEDA_Link: https://www.snapeda.com/parts/61300611121/Wurth%20Electronics%20Inc./view-part/?ref=snap; Package: None; Price: None; Value: *; ComponentLink1Description: Datasheet; ComponentLink1URL: https://www.digikey.com/products/en?keywords=732-5319-ND; Cost: .33; Manufacturer Part Number: 61300611121
L1 = Inductor: FIXED IND 100NH 220MA 680 MOHM; Manufacturer: Murata Electronics North America; Manufacturer Part Number: LQW18ANR10J00D; Vendor Part Number: 490-1179-1-ND; Vendor: Digikey; ComponentLink1Description: Datasheet; ComponentLink1URL: https://www.digikey.com/product-detail/en/murata-electronics-north-america/LQW18ANR10J00D/490-1179-1-ND/584624; Cost: .17; Vendor Description: FIXED IND 100NH 220MA 680 MOHM
L2 = Inductor: FIXED IND 30NH 420MA 230 MOHM; Manufacturer: Murata Electronics North America; Manufacturer Part Number: LQW18AN30NJ00D; Vendor Part Number: 490-6883-1-ND; Vendor: Digikey; ComponentLink1Description: Datasheet; ComponentLink1URL: https://www.digikey.ca/product-detail/en/murata-electronics-north-america/LQW18AN30NJ00D/490-6883-1-ND/3846080; Cost: .25; Vendor Description: FIXED IND 30NH 420MA 230 MOHM
L3 = Inductor: FIXED IND 15NH 600MA 130 MOHM; Manufacturer: Murata Electronics North America; Manufacturer Part Number: LQW18AN15NG00D; Vendor Part Number: 490-6866-1-ND; Vendor: Digikey; ComponentLink1Description: Datasheet; ComponentLink1URL: https://www.digikey.com/product-detail/en/murata-electronics-north-america/LQW18AN15NG00D/490-6866-1-ND/3846063; Cost: .19; Vendor Description: FIXED IND 15NH 600MA 130 MOHM
R1 R2 R6 R7 = Resistor_0603: RES SMD 100K OHM 1% 1/4W 0603; Manufacturer: Rohm Semiconductor; Manufacturer Part Number: ESR03EZPF1003; Vendor Part Number: RHM100KADCT-ND; Vendor: Digikey; ComponentLink1Description: Datasheet; ComponentLink1URL: https://www.digikey.com/product-detail/en/rohm-semiconductor/ESR03EZPF1003/RHM100KADCT-ND/1983754; Cost: .126; Vendor Description: RES SMD 100K OHM 1% 1/4W 0603
R3 R8 = Resistor_0603: Thin Film Resistors 150mW 25Kohms .1% 25ppm; Manufacturer: Vishay / Thin Film; Manufacturer Part Number: PNM0603E2502BST1; Vendor Part Number: 71-PNM0603E2502BST1; Vendor: Mouser; Vendor Description: Thin Film Resistors - SMD 150mW 25Kohms .1% 25ppm; ComponentLink1Description: Datasheet; ComponentLink1URL: https://www.mouser.com/ProductDetail/Vishay-Thin-Film/PNM0603E2502BST1?qs=sGAEpiMZZMvdGkrng054t3MM9KQf0jCWaRJtMFekKwY%3d; Cost: 1.75
RF_IN = 142-0701-201: CONN SMA JACK STR 50 OHM PCB; Manufacturer: Cinch Connectivity Solutions Johnson; Vendor Part Number: J500-ND; Vendor: Digikey; ComponentLink1Description: Datasheet; ComponentLink1URL: https://www.digikey.com/product-detail/en/cinch-connectivity-solutions-johnson/142-0701-201/J500-ND/35274; Cost: 2.79; Manufacturer Part Number: 142-0701-201; Vendor Description: CONN SMA JACK STR 50 OHM PCB
U1 = Component_1: RF Receiver 315MHz/434MHz Superheterodyne Rcvr; Manufacturer: Maxim Integrated; Manufacturer Part Number: MAX1471ATJ+; Vendor Part Number: 700-MAX1471ATJ; Vendor: Mouser; ComponentLink1Description: Datasheet; ComponentLink1URL: https://www.mouser.com/ProductDetail/Maxim-Integrated/MAX1471ATJ%2b?qs=sGAEpiMZZMvxLC1VZo1hVoB57gDFwOQL7RpsI8wlcxI%3d; Cost: 6.54; Vendor Description: RF Receiver 315MHz/434MHz Superheterodyne Rcvr

## Sheet ESS.SchDoc: Energy Storage System (ESS)
size A; Author: Daniel Sherman; Revision: 1.0; SheetNumber: 6; SheetTotal: 10
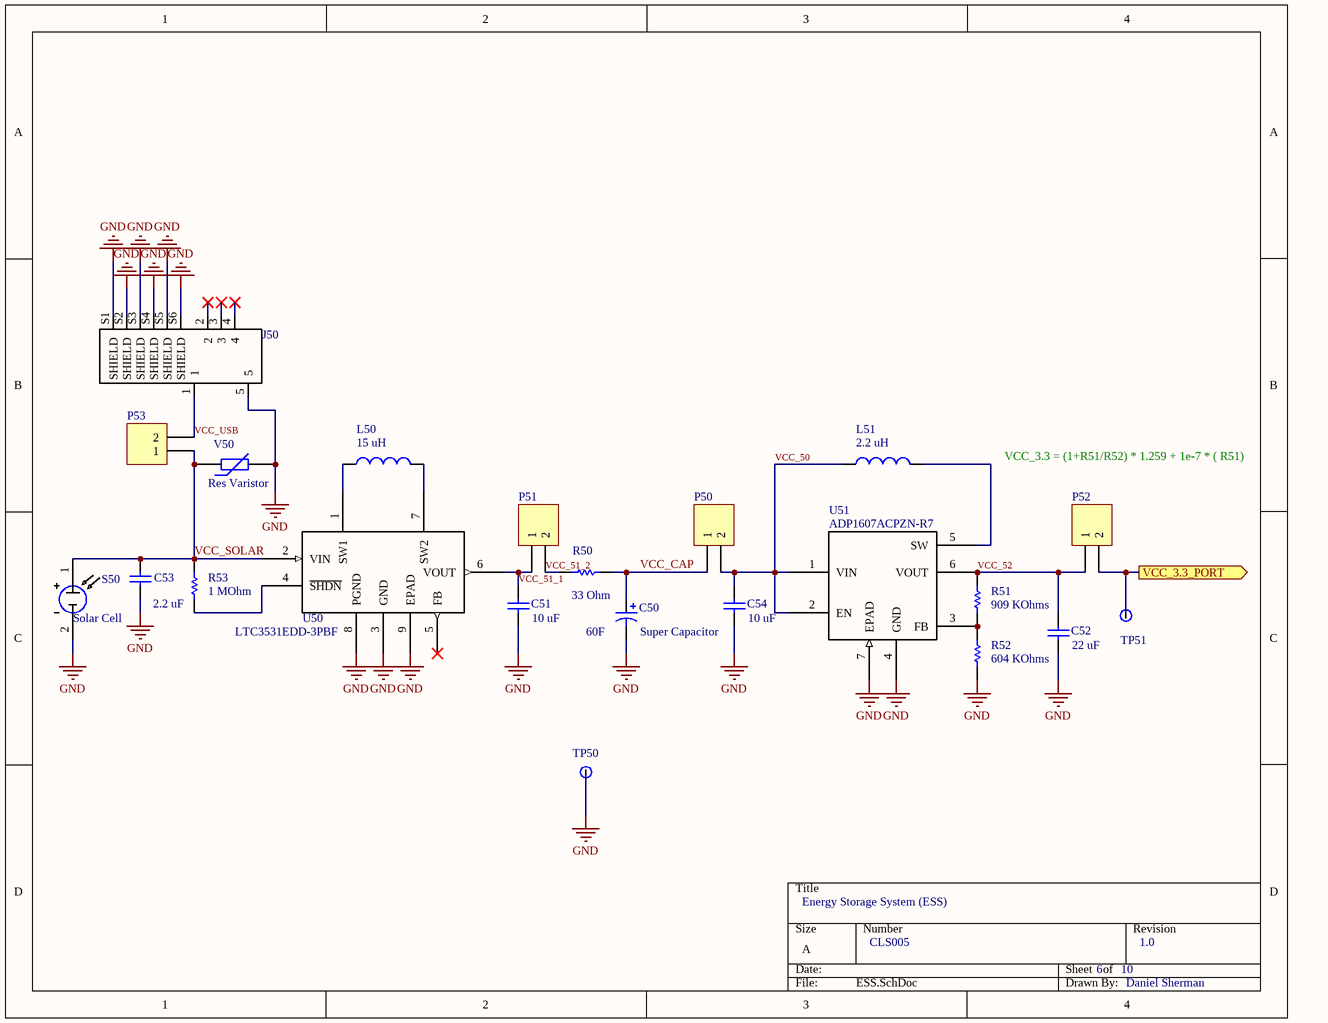
[diagram p7: ESS.SchDoc]

### Parts
C50  Super Capacitor  value 60F  [TV1840-3R0606-R]
C51  value 10 uF  [0805_CHIP_FP]  (hidden comment: Capacitor_unpolarized_0805)
C52  value 22 uF  [0805_CHIP_FP]  (hidden comment: Capacitor_unpolarized_0805)
C53  value 2.2 uF  [0805_CHIP_FP]  (hidden comment: Capacitor_unpolarized_0805)
C54  value 10 uF  [0805_CHIP_FP]  (hidden comment: Capacitor_unpolarized_0805)
J50  2174507-2  [J_SMD_2174507-2-5_7.8_5_2.71_2174507-2(Primary)]  (value not drawn)
L50  value 15 uH  [1919]  (hidden comment: Inductor_0805)
L51  value 2.2 uH  [0805_CHIP_FP]  (hidden comment: Inductor_0805)
P50  Header 2H  [HDR1X2]  (value not drawn)
P51  Header 2H  [HDR1X2]  (value not drawn)
P52  Header 2H  [HDR1X2]  (value not drawn)
P53  Header 2H  [HDR1X2]  (value not drawn)
R50  value 33 Ohm  [0805_CHIP_FP]  (hidden comment: Resistor_0805)
R51  value 909 KOhms  [0805_CHIP_FP]  (hidden comment: Resistor_0805)
R52  value 604 KOhms  [0805_CHIP_FP]  (hidden comment: Resistor_0805)
R53  value 1 MOhm  [0805_CHIP_FP]  (hidden comment: Resistor_0805)
S50  Solar Cell  [HDR1X2]
TP50  Testpoint  [HDR1X1]  (value not drawn)
TP51  Testpoint  [HDR1X1]  (value not drawn)
U50  LTC3531EDD-3PBF  [DFN-8_DD]
U51  ADP1607ACPZN-R7  [ADP1607]
V50  Res Varistor  [6-0805_N]

### Ports
VCC_3.3_PORT (out)

### Nets
GND: C50.2 C51.1 C52.1 C53.1 C54.1 J50.5 J50.S1(SHIELD) J50.S2(SHIELD) J50.S3(SHIELD) J50.S4(SHIELD) J50.S5(SHIELD) J50.S6(SHIELD) R52.1 S50.2 TP50.1(OUT) U50.3(GND) U50.8(PGND) U50.9(EPAD) U51.4(GND) U51.7(EPAD) V50.2
VCC_3.3: P52.2 TP51.1(OUT) ; port VCC_3.3_PORT
VCC_50: C54.2 L51.1 P50.2 U51.1(VIN) U51.2(EN)
VCC_51_1: C51.2 P51.1 U50.6(VOUT)
VCC_51_2: P51.2 R50.1
VCC_52: C52.2 P52.1 R51.2 U51.6(VOUT)
VCC_CAP: C50.1 P50.1 R50.2
VCC_SOLAR: C53.2 P53.1 R53.2 S50.1 U50.2(VIN) V50.1
VCC_USB: J50.1 P53.2
NetL50_1: L50.1 U50.1(SW1)
NetL50_2: L50.2 U50.7(SW2)
NetL51_2: L51.2 U51.5(SW)
NetR51_1: R51.1 R52.2 U51.3(FB)
NetR53_1: R53.1 U50.4(~{SHDN})

Not connected (* = marked no-connect by the designer): J50 2* 3* 4*; U50 5(FB)*

### Notes on the sheet
- VCC_3.3 = (1+R51/R52) * 1.259 + 1e-7 * ( R51)
- CLS005
- Daniel Sherman

### Library data of the parts
C50 = Capacitor Polarized: Manufacturer: Eaton; Vendor: Digikey; Vendor Description: CAP, 3.0V, 60F; ComponentLink1Description: Datasheet; ComponentLink1URL: https://www.digikey.com/products/en?keywords=TV1840-3R0606-R; Cost: 19.46; Manufacturer Part Number: TV1840-3R0606-R; Vendor Part Number: TV1840-3R0606-R
C51 C54 = Capacitor_unpolarized_0805: Manufacturer: Samsung Electro-Mechanics; Manufacturer Part Number: CL21A106KQCLRNC; Vendor Part Number: 1276-2405-1-ND; Vendor: Digikey; Vendor Description: CAP CER 10UF 6.3V X5R 0805; ComponentLink1Description: Datasheet; ComponentLink1URL: https://www.digikey.com/products/en?keywords=1276-2405-1-ND
  C51: Cost: .08
  C54: Cost: .11
C52 = Capacitor_unpolarized_0805: Manufacturer: Samsung Electro-Mechanics; Manufacturer Part Number: CL21A226MQQNNNE; Vendor Part Number: 1276-1100-1-ND; Vendor: Digikey; Vendor Description: CAP CER 22UF 6.3V X5R 0805; ComponentLink1Description: Datasheet; ComponentLink1URL: http://www.samsungsem.com/kr/support/product-search/mlcc/__icsFiles/afieldfile/2018/06/20/CL21A226MQQNNNE.pdf; Cost: 0.22
C53 = Capacitor_unpolarized_0805: Manufacturer: Wurth Electronics Inc.; Manufacturer Part Number: 885012107001; Vendor Part Number: 732-7612-1-ND; Vendor: Digikey; Vendor Description: CAP CER 2.2UF 6.3V X5R 0805; ComponentLink1Description: Datasheet; ComponentLink1URL: https://www.digikey.com/products/en?keywords=732-7612-1-ND; Cost: .14
J50 = 2174507-2: Manufacturer: TE Connectivity AMP Connectors; Vendor Part Number: A118106CT-ND; Vendor: Digikey; Vendor Description: REC TYPE-B ASSY MICRO USB I/O; Value: *; ComponentLink1Description: Datasheet; ComponentLink1URL: https://www.digikey.com/product-detail/en/te-connectivity-amp-connectors/2174507-2/A118106CT-ND/4729913; Cost: 2.88; Manufacturer Part Number: 2174507-2
L50 = Inductor_0805: Manufacturer: Wurth Electronics Inc.; Manufacturer Part Number: 744042150; Vendor Part Number: 732-3655-1-ND; Vendor: Digikey; Vendor Description: FIXED IND 15UH 1.03A 220 MOHM; ComponentLink1Description: Datasheet; ComponentLink1URL: https://katalog.we-online.de/pbs/datasheet/744042150.pdf; Cost: 1.43
L51 = Inductor_0805: Manufacturer: Taiyo Yuden; Manufacturer Part Number: BRC2012T2R2MD; Vendor Part Number: 587-2905-1-ND; Vendor: Digikey; Vendor Description: FIXED IND 2.2UH 1A 143 MOHM SMD; ComponentLink1Description: Datasheet; ComponentLink1URL: https://www.digikey.com/products/en?keywords=587-2905-1-ND; Cost: .35
P50-P53 = Header 2H: Vendor Part Number: PRT-00116; Vendor: Sparkfun; Vendor Description: .100 mil pitch male header x2; ComponentLink1Description: Datasheet; ComponentLink1URL: https://www.sparkfun.com/products/116; Cost: bulk
R50 = Resistor_0805: Manufacturer: Panasonic Electronic Components; Manufacturer Part Number: ERJ-P06J330V; Vendor Part Number: P33ADCT-ND; Vendor: Digikey; Vendor Description: RES SMD 33 OHM 5% 1/2W 0805; ComponentLink1Description: Datasheet; ComponentLink1URL: https://www.digikey.com/products/en?keywords=P33ADCT-ND; Cost: .12
R51 = Resistor_0805: Manufacturer: Yageo; Manufacturer Part Number: RC0805FR-07909KL; Vendor Part Number: 311-909KCRCT-ND; Vendor: Digikey; Vendor Description: RES SMD 909K OHM 1% 1/8W 0805; ComponentLink1Description: Datasheet; ComponentLink1URL: https://www.digikey.com/products/en?keywords=311-909KCRCT-ND; Cost: .10
R52 = Resistor_0805: Manufacturer: Yageo; Manufacturer Part Number: RC0805FR-07604KL; Vendor Part Number: 311-604KCRCT-ND; Vendor: Digikey; Vendor Description: RES SMD 604K OHM 1% 1/8W 0805; ComponentLink1Description: Datasheet; ComponentLink1URL: https://www.digikey.com/products/en?keywords=311-604KCRCT-ND; Cost: .10
R53 = Resistor_0805: as R71 on sheet IO; ComponentLink1Description: Datasheet; ComponentLink1URL: https://www.digikey.com/products/en?keywords=311-1.00MCRCT-ND; Cost: .05
S50 = Solar Cell: IXOLAR SLMD121H08L; Manufacturer: IXYS; Vendor Part Number: SLMD121H08L-ND; Vendor: Digikey; Vendor Description: MONO SOLAR CELL 86MM X 14MM; ComponentLink1Description: Datasheet; ComponentLink1URL: https://www.digikey.com/product-detail/en/ixys/SLMD121H08L/SLMD121H08L-ND/3463125; Cost: 10.23; Manufacturer Part Number: SLMD121H08L
TP50 TP51 = Testpoint: as TP0 on sheet Top; ComponentLink1URL: https://www.sparkfun.com/products/116; ComponentLink1Description: Datasheet; Manufacturer: Sparkfun; Manufacturer Part Number: PRT-00116; Cost: bulk
U50 = LTC3531EDD-3PBF: LTC3531 - 200mA Buck-Boost Synchronous DC/DC Converters; Manufacturer: Linear Technology; Vender Part Number: LTC3531EDD-3#PBF-ND; Manufacturer Part Number: LTC3531EDD-3#PBF; Vender: Digikey; Vender Description: IC REG BUCK BST 3.02V 0.2A 8DFN; Cost: 4.00; SnapEDA_Link: https://www.snapeda.com/parts/LTC3531EDD-3%23PBF/Linear%20Technology/view-part/?ref=snap; ComponentLink1Description: Datasheet; ComponentLink1URL: https://www.analog.com/media/en/technical-documentation/data-sheets/3531fb.pdf
U51 = ADP1607ACPZN-R7: Manufacturer: Analog Devices Inc.; Vendor Part Number: ADP1607ACPZN-R7CT-ND; Vendor: Digikey; Vendor Description: IC REG BOOST ADJ 1A SYNC 6LFCSP; ComponentLink1Description: Datasheet; ComponentLink1URL: https://www.digikey.com/products/en?keywords=ADP1607ACPZN-R7CT-ND; Cost: 3.40; Manufacturer Part Number: ADP1607ACPZN-R7
V50 = Res Varistor: Varistor (Voltage-Sensitive Resistor); Manufacturer: Littelfuse Inc.; Manufacturer Part Number: V5.5MLA0805NH; Vendor Part Number: F3814CT-ND; Vendor: Digikey; Vendor Description: VARISTOR 8.2V 120A 0805; ComponentLink1Description: Datasheet; ComponentLink1URL: http://www.littelfuse.com/~/media/electronics/datasheets/varistors/littelfuse_varistor_mla_datasheet.pdf.pdf; Cost: 0.53

## Sheet Reset.SchDoc: Reset
size A; Author: Micheal Burin; Revision: 1.0; SheetNumber: 5; SheetTotal: 10
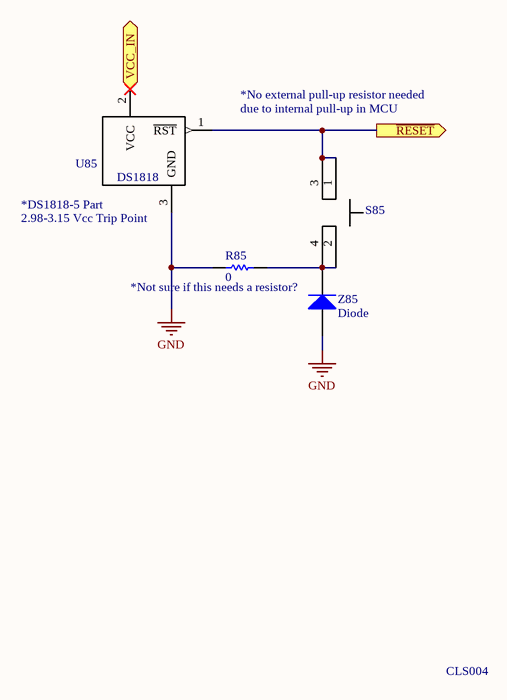
[diagram p8: Reset.SchDoc]

### Parts
R85  value 0  [0603_CHIP_FP]  (hidden comment: Resistor)
S85  Switch  [Pushbutton]  (value not drawn)
U85  DS1818  [SOT95P240X110-3N]
Z85  Diode  [0603_CHIP_FP]

### Ports
VCC_IN (in), ~{RESET} (out)

### Nets
GND: R85.1 U85.3(GND) Z85.2(Cathode)
VCC_3.3: U85.2(VCC) ; port VCC_IN
NetG95_15: S85.1 S85.3 U85.1(~{RST}) ; port ~{RESET}
NetR85_2: R85.2 S85.2 S85.4 Z85.1(Anode)

### Notes on the sheet
- *No external pull-up resistor needed
- due to internal pull-up in MCU
- (near U85) *DS1818-5 Part
- (near U85) 2.98-3.15 Vcc Trip Point
- (near Z85) *Not sure if this needs a resistor?
- CLS004

### Library data of the parts
R85 = Resistor_0603: Manufacturer: Vishay Dale; Manufacturer Part Number: CRCW08050000Z0EA; Vendor Part Number: 541-0.0ACT-ND; Vendor: Digikey; Vendor Description: RES SMD 0 OHM JUMPER 1/8W 0805; ComponentLink1Description: Datasheet; ComponentLink1URL: https://www.digikey.com/product-detail/en/vishay-dale/CRCW08050000Z0EA/541-0.0ACT-ND/1180267; Cost: .04
S85 = Pushbutton: as S70 on sheet IO; ComponentLink1Description: Datasheet; ComponentLink1URL: https://www.digikey.com/product-detail/en/apem-inc/MJTP1230/679-2428-ND/1798037; Cost: .11
U85 = DS1818_5: 3.3V EconoReset with Pushbutton; Manufacturer: Maxim Integrated; Manufacturer Part Number: DS1818R-5+T&R; Vendor Part Number: DS1818R-5+CT-ND; Value: 3.06V; Vendor: Digikey; Vendor Description: IC 3.06V W/PB 5% SOT23-3; ComponentLink1Description: Datasheet; ComponentLink1URL: https://www.digikey.com/product-detail/en/maxim-integrated/DS1818R-5-T-R/DS1818R-5-CT-ND/1566808; Cost: 2.62
Z85 = Diode: as Z70 on sheet IO; ComponentLink1Description: Datasheet; ComponentLink1URL: https://www.digikey.com/product-detail/en/stmicroelectronics/ESDA7P120-1U1M/497-17159-1-ND/6709859; Cost: .38